# EAGLE design Adafruit BME680 Original (EAGLE 6.4)
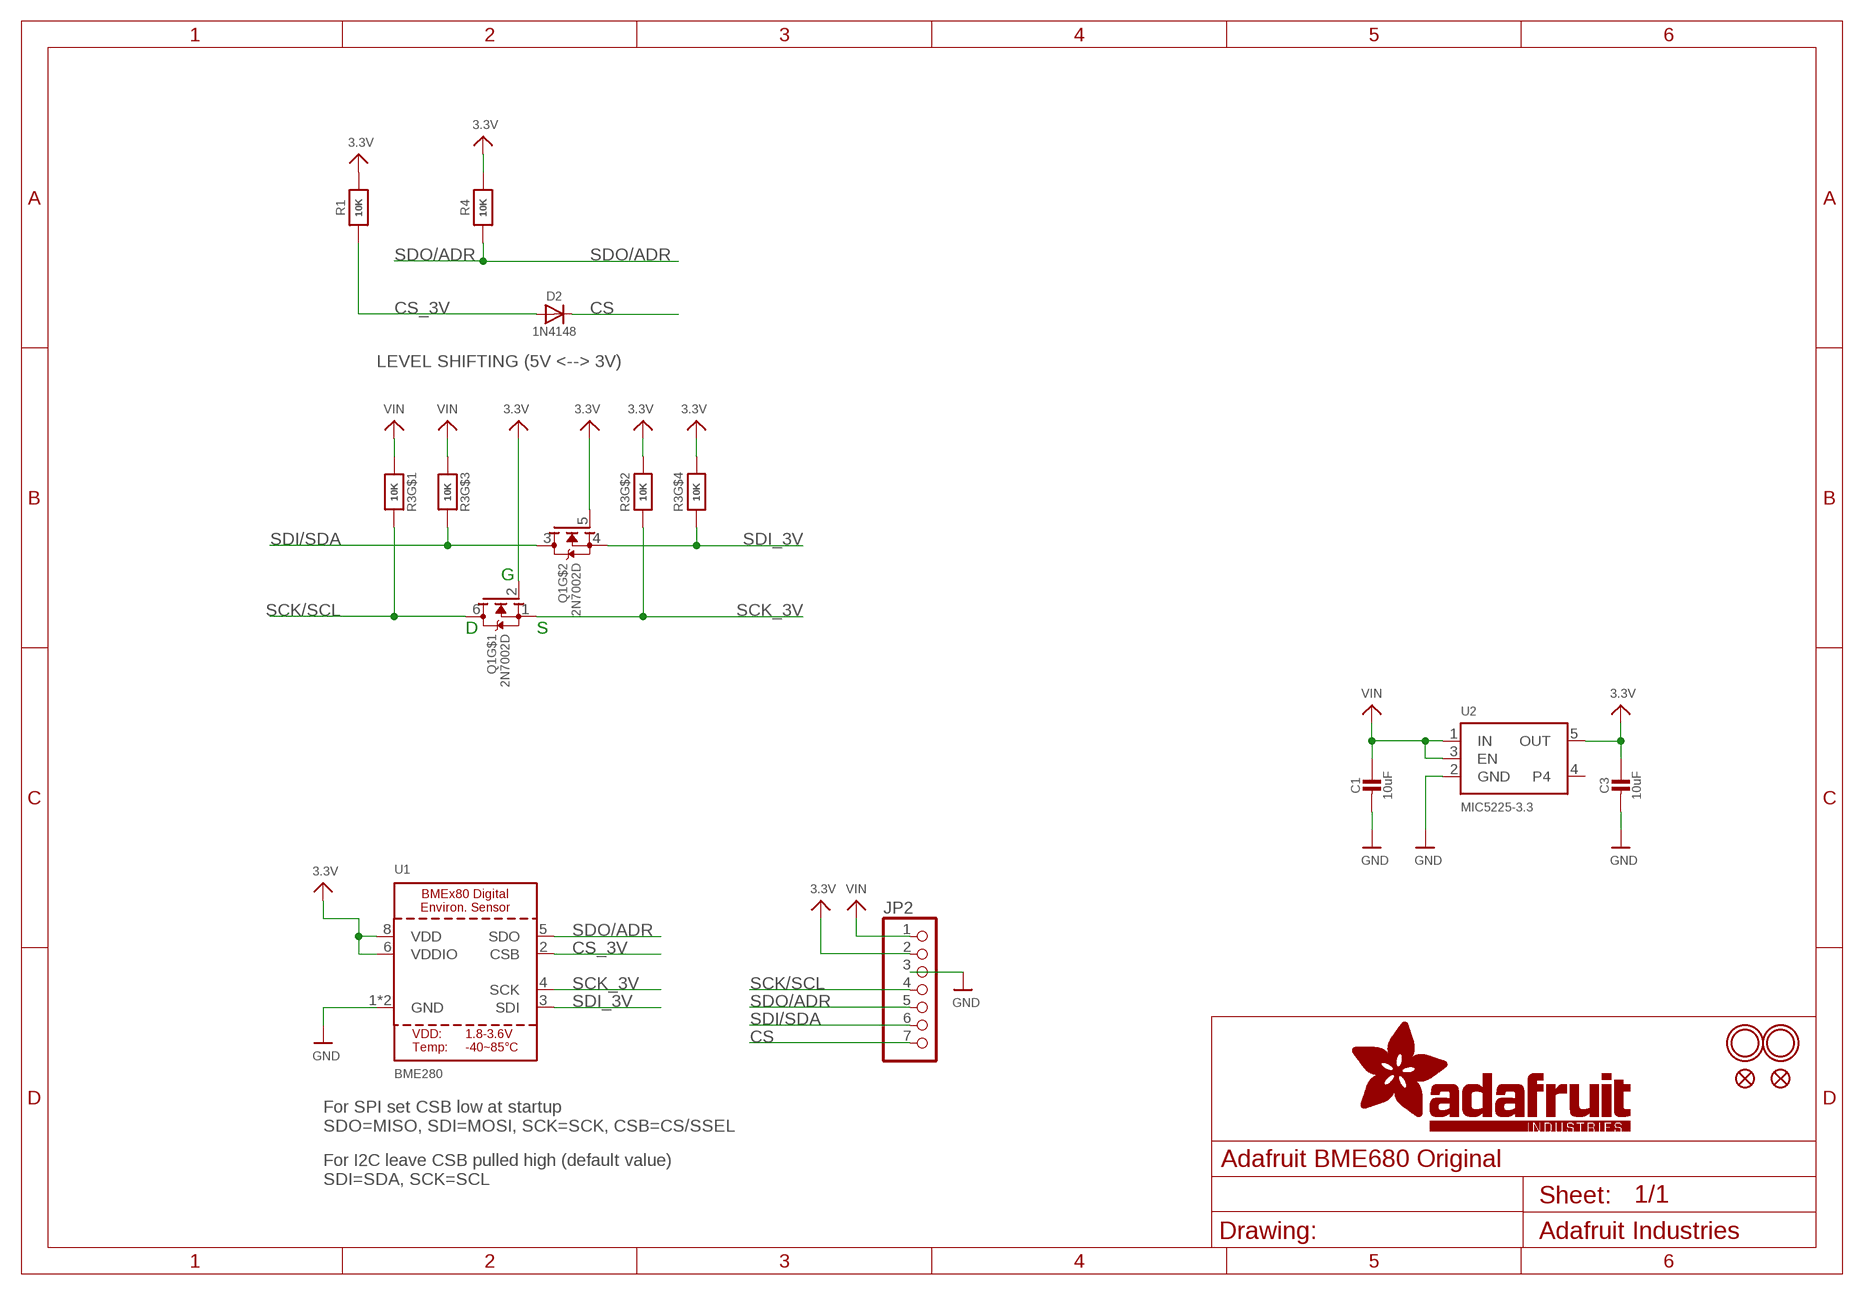
[diagram p0: schematic, sheet 1]

## Parts
C1  10uF  CAP_CERAMIC0805-NOOUTLINE  [0805-NO]
C3  10uF  CAP_CERAMIC0805-NOOUTLINE  [0805-NO]
D2  1N4148  DIODESOD-323  [SOD-323]
JP2  HEADER-1X770MIL  [1X07_ROUND_70]
Q1  2N7002D  MOSFET-N_DUAL  [SOT363]
R1  10K  RESISTOR_0603_NOOUT  [0603-NO]
R3  10K  RESISTOR_4PACK  [RESPACK_4X0603]
R4  10K  RESISTOR_0603_NOOUT  [0603-NO]
U1  BME280  BME680  [BME680]
U2  MIC5225-3.3  VREG_SOT23-5  [SOT23-5]
U$5  FIDUCIAL_1MM  [FIDUCIAL_1MM]
U$7  MOUNTINGHOLE2.0  [MOUNTINGHOLE_2.0_PLATED]
U$8  MOUNTINGHOLE2.0  [MOUNTINGHOLE_2.0_PLATED]
U$15  FIDUCIAL_1MM  [FIDUCIAL_1MM]

## Nets
3.3V: C3.1 JP2.2 Q1.2(G) Q1.5(G) R1.2 R3.2 R3.4 R4.2 U1.6(VDDIO) U1.8(VDD) U2.5(OUT)
CS: D2.C JP2.7
CS_3V: D2.A R1.1 U1.2(CSB)
GND: C1.2 C3.2 JP2.3 U1.1(GND) U1.7(GND) U2.2(GND)
SCK/SCL: JP2.4 Q1.6(D) R3.8
SCK_3V: Q1.1(S) R3.7 U1.4(SCK)
SDI/SDA: JP2.6 Q1.3(D) R3.6
SDI_3V: Q1.4(S) R3.5 U1.3(SDI)
SDO/ADR: JP2.5 R4.1 U1.5(SDO)
VIN: C1.1 JP2.1 R3.1 R3.3 U2.1(IN) U2.3(EN)
Unconnected: U2.4

## Notes on the sheet
- LEVEL SHIFTING (5V <--> 3V)
- G
- D | S
- For SPI set CSB low at startup
  SDO=MISO, SDI=MOSI, SCK=SCK, CSB=CS/SSEL
- For I2C leave CSB pulled high (default value)
  SDI=SDA, SCK=SCL

## Library data of the parts
C1 C3 = microbuilder:CAP_CERAMIC: Ceramic Capacitors For new designs, use the packages preceded by an '_' character since they are more reliable: The following footprints should be used on most boards: _0402 - Standard footprint for regular board layouts _0603 - Standard footprint for regular board layouts _0805 - Standard footprint for regular board layouts _1206 - Standard footprint for regular board layouts For extremely tight-pitch boards where space is at a premium, the following 'micro-pitch' footprints can be used (smaller pads, no silkscreen outline, etc.): _0402MP - Micro-pitch footprint for very dense/compact boards _0603MP - Micro-pitch footprint for very dense/compact boards _0805MP - Micro-pitch footprint for very dense/compact boards _1206MP - Micro-pitch footprint for very dense/compact boards
D2 = microbuilder:DIODE: Diode SMA Model Volts Amps Type Vf Ir Digikey # Notes SSA34-E3 40V 3A Schottky 480mV @ 3A 200uA @ 40V SSA34-E3/61TGITR-ND CDBA120-G 20V 1A Schottky 500mV @ 1A 500uA @ 20V 641-1014-6-ND REEL MBRA210 10V 2A Schottky 350mV @ 2A 700uA @ 10V MBRA210LT3 SOD-123 Model Volts Amps Type Vf Ir Order # Notes BAT54T1G 30V 200mA Schottky 800mV @ 200mA 2uA @ 25V BAT54T1GOSTR-ND B0530W 30V 500mA Schottky 430mV @ 500mA 130uA @ 30V B0530W-FDICT-ND REEL MBR120 20V 1A Schottky 340mV @ 1A MBR120VLSFT1GOSCT-ND SOD-323 Model Volts Amps Type Vf Ir Order # Notes PMEG2005EJ 20V 500mA Schottky 355mV @ 500mA 568-4110-1-ND ZLLS410 10V 570mA Schottky 380mV @ 570mA ZLLS410CT-ND 1N4148WS 75V 150mA Silicon/Simple 1V 1N4148WSFSCT-ND REEL SOD-523 Model Volts Amps Type Vf Ir Order # Notes BAT54XV2 30V 200mA Schottky 0.8V @ 100mA BAT54XV2CT-ND TB751S 30V 30mA Schottky RB751S-40TE61CT-ND SOT23-R/W (R = Solder Paste/Reflow Ovens, W = Hand-Soldering) Model Volts Amps Type Vf Ir Order # Notes BAT54FILM 40V 300mA Schottky 497-7162-1-ND POWERDI-5 Model Volts Amps Type Vf Ir Order # Notes PDS560 60V 5A Schottky 670mV @ 5A 150uA @ 60V PDS560DICT-ND
JP2 = microbuilder:HEADER-1X7: PIN HEADER
Q1 = microbuilder:MOSFET-N_DUAL: Dual N-Channel MOSFET SOT363 (2.0x1.25mm) 2N7002PS - 60V, 320mA [Digikey: 568-5984-1-ND]
R1 R4 = microbuilder:RESISTOR: Resistors For new designs, use the packages preceded by an '_' character since they are more reliable: The following footprints should be used on most boards: _0402 - Standard footprint for regular board layouts _0603 - Standard footprint for regular board layouts _0805 - Standard footprint for regular board layouts _1206 - Standard footprint for regular board layouts For extremely tight-pitch boards where space is at a premium, the following 'micro-pitch' footprints can be used (smaller pads, no silkscreen outline, etc.): _0402MP - Micro-pitch footprint for very dense/compact boards _0603MP - Micro-pitch footprint for very dense/compact boards _0805MP - Micro-pitch footprint for very dense/compact boards _1206MP - Micro-pitch footprint for very dense/compact boards
R3 = microbuilder:RESISTOR_4PACK: Resistor Packs (4 resistors) 4 x 0603 10K 1/16W - Digikey: YC164J-10KCT-ND
U1 = microbuilder:BME680
U2 = microbuilder:VREG_SOT23-5: SOT23-5 Fixed Voltage Regulators Part Current Out V Out V In V Dropout θJA (°C/W) TJ (°C) Digikey Part No. ADP121 150mA 3.3V 3.4-5.5V 0.09V @ 150mA -- -- ADP121-AUJZ33R7CT-ND ADP121 150mA 3.0V 3.1-5.5V 0.09V @ 150mA -- -- ADP121-AUJZ30R7CT-ND ADP122 300mA 3.3V 3.4-5.5V 0.085V @ 300mA -- -- ADP122AUJZ-3.3-R7CT-ND ADP1712 300mA 3.3V 3.5-5.5V 0.17V @ 300mA -- -- ADP1712AUJZ-3.3-R7TR-ND AP7311 (Low Cost) 150mA 3.3V 3.5-6V 0.15V @ 150mA -- -- AP7311-33WG-7DICT-ND LD39015M18R 150mA 1.8V 1.9V-5.5V 0.08V @ 100mA -- -- 497-6977-1-ND LP2985A-33DBVR 150mA 3.3V 3.3-16V 0.28V @ 150mA 206 150 296-18479-1-ND MCP1824T-3302E/OT 300mA 3.3V 3.5V-6V 0.2V @ 300mA -- -- MCP1824T-3302E/OTCT-ND MIC5205-2.5YM5 TR 150mA 2.5V 2.7-16V 0.165V @ 150mA -- -- 576-1257-2-ND MIC5205-3.0YM5 TR 150mA 3.0V 3.2V-16V 0.165V @ 150mA -- -- 576-1258-2-ND MIC5205-3.3YM5 TR 150mA 3.3V 3.5V-16V 0.165V @ 150mA -- -- 576-1259-2-ND TPS780330220 150mA 3.3V+2.2V 3.6-5.5V 250mV Max -- -- 296-23332-1-ND TDA3663/N1,135 100mA 3.3V 3.5-45V 0.18V @ 50mA -- -- 568-5343-1-ND Max operating temp can be calculated using θJA, TJ (max junction temperature), and power in watts. Set the "Maximum Ambient Temperature" until it reaches TJ ("Max Junction Temperature"), which is the absolute limit for safe use of the regulator: Heat Sink Temperature Calculator <http://www.daycounter.com/Calculators/Heat-Sink-Temperature-Calculator.phtml> For example, With 12V source into a 3.3V LP2985 and a 30mA load, we are dissipating (12V-3.3V) * 0.03A = 0.261W. With a θJA of 206 °C/W, a TJ of 150°C, and 261mW we can safely use the chip without a heat sink up to 75°C (=147.1°C Junction Temperature).
U$5 U$15 = microbuilder:FIDUCIAL: Fiducial Alignment Points Various fiducial points for machine vision alignment.; BOM: EXCLUDE
U$7 U$8 = microbuilder:MOUNTINGHOLE: Mounting Hole For #2 screws (0.086"/2.18mm width, 0.094"/2.4mm hole) use 2.5mm; BOM: EXCLUDE

## Board
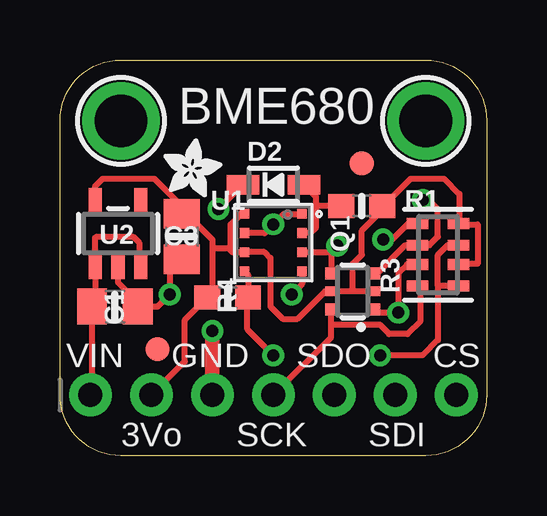
[diagram p1: board, top side]
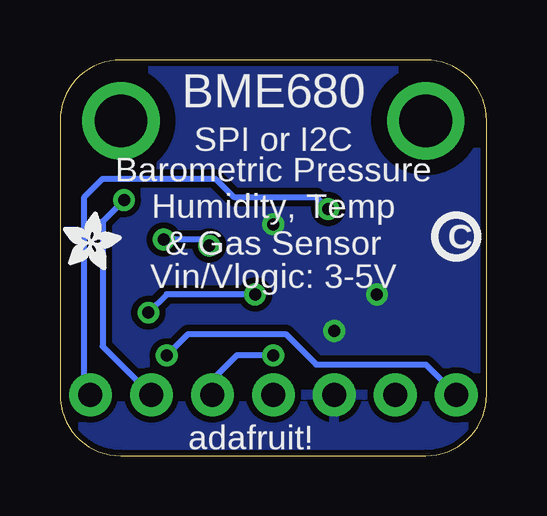
[diagram p2: board, bottom side, seen from below]

Size 17.78 x 16.51 mm. Coordinates in mm from the lower left corner, seen from the top.
Outline: 15.24,0 2.54,0 arc-90 0,2.54 0,13.97 arc-90 2.54,16.51 15.24,16.51 arc-90 17.78,13.97 17.78,2.54 arc-90 15.24,0
Copper layers (1*16): Top 0.035mm / dielectric 1.5mm / Bottom 0.035mm
Design rules "adafruit *": minimum track width 8mil, minimum drill 15.5mil, track to track 8mil, track to pad 8mil, pad to pad 8mil, via to via 8mil, smd to smd 8mil, copper to edge 10mil, drill to drill 8mil, minimum pad ring 10mil, minimum via ring 8mil, stop-mask expansion 2mil, vias tented up to drill 20mil, thermal gap 10mil

### Footprints (pad centres in the part's own frame; a part is rotated, then mirrored left to right if it is on the bottom)
0805-NO = smd 1.24 x 1.5: 1 -0.95,0; 2 0.95,0
SOD-323 = smd 1.35 x 0.8: A 1.27,0; C -1.27,0
1X07_ROUND_70 = drill 1 pad 1.778: 1 -7.62,0; 2 -5.08,0; 3 -2.54,0; 4 0,0; 5 2.54,0; 6 5.08,0; 7 7.62,0
SOT363 = smd 0.5 x 0.5: 1 -0.75,-0.9; 3 0.75,-0.9; 4 0.75,0.9; 6 -0.75,0.9 | smd 0.4 x 0.5: 2 0,-0.9; 5 0,0.9
0603-NO = smd 1.075 x 1: 1 -0.85,0; 2 0.85,0
RESPACK_4X0603 = smd 0.45 x 0.9: 1 -1.3,-0.85; 2 -0.4,-0.85; 3 0.4,-0.85; 4 1.3,-0.85; 5 1.3,0.85; 6 0.4,0.85; 7 -0.4,0.85; 8 -1.3,0.85
BME680 = smd 0.4 x 0.4: 1 1.2,1.2; 2 1.2,0.4; 3 1.2,-0.4; 4 1.2,-1.2; 5 -1.2,-1.2; 6 -1.2,-0.4; 7 -1.2,0.4; 8 -1.2,1.2
SOT23-5 = smd 0.55 x 1.2: 1 -0.95,-1.3; 2 0,-1.3; 3 0.95,-1.3; 4 0.95,1.3; 5 -0.95,1.3
FIDUCIAL_1MM = smd 1 x 1: 1 0,0
MOUNTINGHOLE_2.0_PLATED = drill 2.2 pad 3: P$1 0,0

### Placement (x,y rotation side)
C1  2.29,6.22 0 top
C3  5.08,9.14 270 top
D2  8.89,11.3 0 top
JP2  8.89,2.54 0 top
Q1  12.19,6.86 90 top
R1  12.57,10.41 0 top
R3  15.75,8.38 90 top
R4  6.99,6.6 180 top
U1  8.89,8.89 0 top
U2  2.41,9.27 0 top
U$2  [ADAFRUIT_2.5MM]  17.65,7.75 0 bottom
U$5  4.06,4.45 0 top
U$6  [ADAFRUIT_2.5MM]  4.32,10.79 0 top
U$7  2.54,13.97 0 top
U$8  15.24,13.97 0 top
U$15  12.57,12.19 0 top
U$20  [PCBFEAT-REV-040]  1.27,9.14 0 bottom

### Tracks (layer width: path | path; a pad name or v marks a point on that pad's centre or on a via)
3.3V
  Top 0.254: 12.19,6.86 Q1.5 11.05,6.86 9.91,5.71 9.27,5.71 8.76,6.22 8.76,8.26 8.53,8.49 U1.6 7.19,8.49 7.11,8.56 | 12.19,6.86 12.19,8 12.57,8.38 12.57,9.4 13.42,10.25 R1.2 13.46,10.41 14.61,11.56 16,11.56 16.64,10.92 16.64,9.72 R3.4 16.6,9.65 17.4,9.65 17.4,8 16.6,8 R3.2 | 7.11,8.56 7.11,9.65 7.55,10.09 U1.8 | U2.5 1.46,11.24 1.78,11.56 3.94,11.56 5.08,10.41 | 5.08,10.41 C3.1 | 5.08,10.41 5.59,9.91 5.59,9.78 6.35,9.02 6.35,8.64 | Q1.2 12.19,6.86 | 7.11,8.56 7.04,8.64 6.35,8.64 | JP2.2 5.21,3.94 5.21,5.68 R4.2 6.35,6.82 6.35,8.64
CS  (via drill 0.5)
  Top 0.254: D2.C v6.6,10.29
  Bottom 0.254: JP2.7 16.38,2.54 16.76,2.92 16.76,10.79 16,11.56 11.3,11.56 10.54,10.79 7.11,10.79 v6.6,10.29
CS_3V
  Top 0.254: 10.67,10.41 10.67,9.53 10.43,9.29 U1.2 | R1.1 10.67,10.41 | 10.67,10.41 10.67,10.79 D2.A
GND  (via drill 0.5)
  Top 0.254: U2.2 2.41,7.24 3.24,6.42 C1.2 4.06,6.22 v4.57,6.73 4.57,7.69 C3.2 | U1.1 9.33,10.09 v8.89,9.65 8.53,9.29 U1.7
  Top 0.61: JP2.3 v6.35,5.21
  pour Bottom (isolate 0.254): 0,16.51 17.78,16.51 17.91,0 0.13,0
SCK/SCL
  Top 0.254: JP2.4 11.29,4.94 11.29,5.46 | 11.29,5.46 Q1.6 | 11.29,5.46 13.34,5.46 13.72,5.08 14.48,5.08 15.03,5.63 15.03,6.96 R3.8
SCK_3V  (via drill 0.5)
  Top 0.254: R3.7 14.46,7.98 14.1,7.62 v14.1,5.97 13.23,5.97 Q1.1 | U1.4 10.09,7.17 v9.65,6.73
  Bottom 0.254: v9.65,6.73 13.34,6.73 v14.1,5.97
SDI/SDA  (via drill 0.5)
  Top 0.254: 14.46,8.78 R3.6 | R3.6 15.39,8.78 15.75,9.14 15.75,10.29 15.37,10.67 v15.11,10.67 | R3.6 14.39,8.78 13.22,7.61 Q1.3
  Bottom 0.254: v15.11,10.67 16,9.78 16,4.57 JP2.6
SDI_3V  (via drill 0.5)
  Top 0.254: v11.56,8.76 11.29,8.5 Q1.4 | R3.5 14.51,9.68 13.84,9.02 v13.46,9.02 | 11.36,8.56 v11.56,8.76 | U1.3 11.28,8.49 v11.56,8.76
  Bottom 0.254: v11.56,8.76 11.81,9.02 v13.46,9.02
SDO/ADR  (via drill 0.5)
  Top 0.254: 8.7,4.38 v8.89,4.19 7.81,5.27 7.81,6.58 R4.1 | 7.81,6.63 R4.1 | U1.5 7.83,7.54 R4.1
  Bottom 0.254: v8.89,4.19 10.41,4.19 11.43,3.17 JP2.5
VIN  (via drill 0.5)
  Top 0.254: U2.3 3.3,8.03 3.3,8.89 3.05,9.14 1.52,9.14 1.46,9.08 U2.1 1.46,6.22 C1.1 1.34,2.61 JP2.1 | R3.1 15.75,7.08 | 15.75,7.08 15.75,8.38 16.15,8.78 R3.3 | 15.75,7.08 15.75,4.83 15.11,4.19 v13.34,4.19
  Bottom 0.254: v13.34,4.19 12.45,5.08 8.38,5.08 7.11,3.81 2.54,3.81 JP2.1 1.34,2.61

### Text on the board
tPlace: BME680 | VIN | GND | SDO | CS | 3Vo | SCK | SDI
bPlace: BME680 | SPI or I2C | Barometric Pressure / Humidity, Temp / & Gas Sensor | Vin/Vlogic: 3-5V | adafruit!